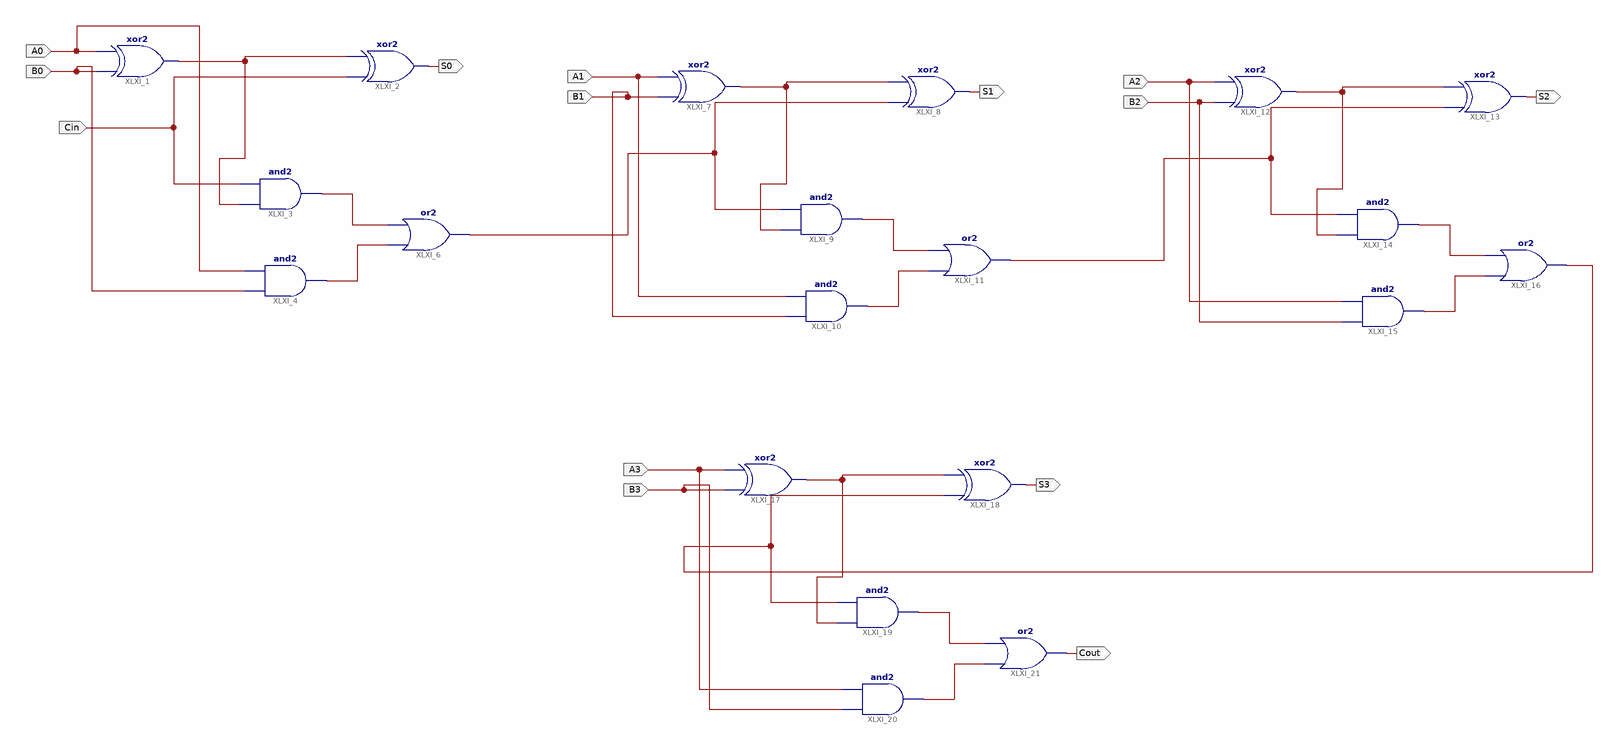
[diagram p0: schematic sheet 1]
// Xilinx ISE schematic Labo7part2.sch (xa9500xl) as structural Verilog: 20 symbols, 14 ports
module Labo7part2 (
  input  Cin,
  input  A0,
  input  B0,
  input  A1,
  input  B1,
  input  A2,
  input  B2,
  input  A3,
  input  B3,
  output S0,
  output S1,
  output S2,
  output S3,
  output Cout
);

  wire XLXN_2, XLXN_3, XLXN_4, XLXN_6, XLXN_7, XLXN_9, XLXN_13, XLXN_16, XLXN_17, XLXN_18, XLXN_20, XLXN_23,
       XLXN_24, XLXN_25, XLXN_27;

  xor XLXI_1 (XLXN_2, B0, A0);
  xor XLXI_2 (S0, Cin, XLXN_2);
  and XLXI_3 (XLXN_3, XLXN_2, Cin);
  and XLXI_4 (XLXN_4, B0, A0);
  or XLXI_6 (XLXN_13, XLXN_4, XLXN_3);
  xor XLXI_7 (XLXN_9, B1, A1);
  xor XLXI_8 (S1, XLXN_13, XLXN_9);
  and XLXI_9 (XLXN_6, XLXN_9, XLXN_13);
  and XLXI_10 (XLXN_7, B1, A1);
  or XLXI_11 (XLXN_20, XLXN_7, XLXN_6);
  xor XLXI_12 (XLXN_16, B2, A2);
  xor XLXI_13 (S2, XLXN_20, XLXN_16);
  and XLXI_14 (XLXN_17, XLXN_16, XLXN_20);
  and XLXI_15 (XLXN_18, B2, A2);
  or XLXI_16 (XLXN_27, XLXN_18, XLXN_17);
  xor XLXI_17 (XLXN_23, B3, A3);
  xor XLXI_18 (S3, XLXN_27, XLXN_23);
  and XLXI_19 (XLXN_24, XLXN_23, XLXN_27);
  and XLXI_20 (XLXN_25, B3, A3);
  or XLXI_21 (Cout, XLXN_25, XLXN_24);
endmodule
